# Altium project slave.PrjPcb
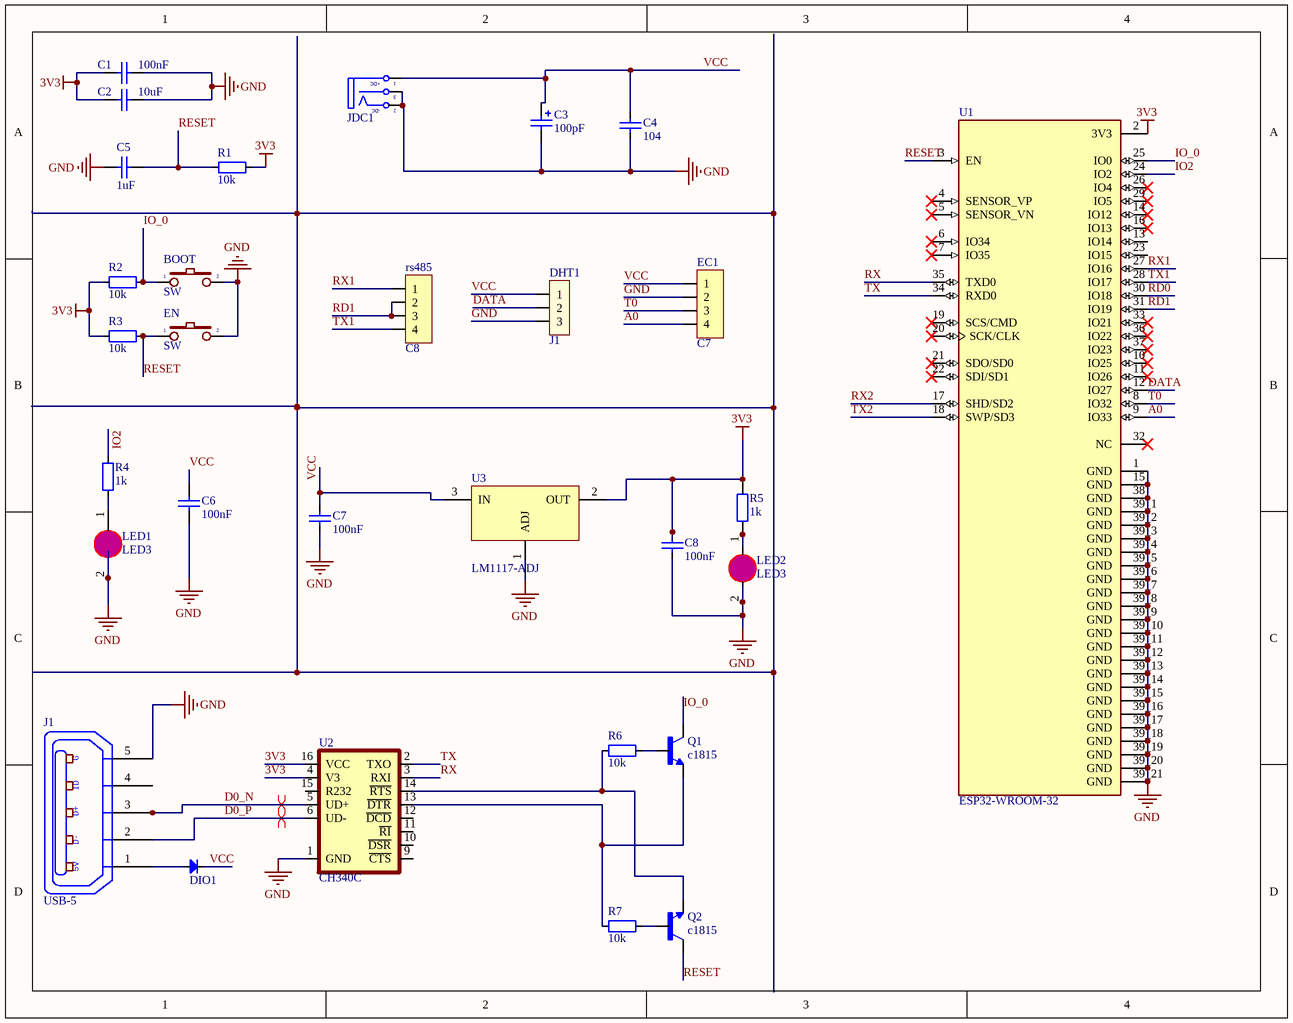
[diagram p0: mach slave.SchDoc]
1 sheet, 30 parts. Net scope: global (net labels, ports and power ports of the same name join across sheets).
Board file: slave.PcbDoc

## Sheet mach slave.SchDoc
size A

### Parts
BOOT  SW  [SW-SMD]
C1  100nF  [CAP_0805]
C2  10uF  [CAP_0805]
C3  value 100pF  [CAP-ALU-SMD-C]  (hidden comment: Cap Pol SMD)
C4  104  [CAP_0805]
C5  1uF  [CAP_0805]
C6  100nF  [CAP_0805]
C7  100nF  [CAP_0805]
C8  100nF  [CAP_0805]
DHT1  J1  [JP3]
DIO1  Diode SMD  [DIO-SMD-106]  (value not drawn)
EC1  C7  [JP4-C1T]
EN  SW  [SW-SMD]
J1  USB-5  [USB-M1]
JDC1  Jack DC  [DC-IN]  (value not drawn)
LED1  LED3  [LED0805]
LED2  LED3  [LED0805]
Q1  c1815  [SOT95P240X97-3N]
Q2  c1815  [SOT95P240X97-3N]
R1  10k  [RES-SMD-0805]
R2  10k  [RES-SMD-0805]
R3  10k  [RES-SMD-0805]
R4  1k  [RES-SMD-0805]
R5  1k  [RES-SMD-0805]
R6  10k  [RES-SMD-0603]
R7  10k  [RES-SMD-0603]
rs485  C8  [JP4-C1T]
U1  ESP32-WROOM-32  [MODULE_ESP32-WROOM-32]
U2  CH340C  [SOP-16]
U3  LM1117-ADJ  [LM1117-SOP]

### Nets
3V3: C1.1 C2.1 C8.2 R1.1 R2.2 R3.2 R5.1 U1.2(3V3) U2.4(V3) U2.16(VCC) U3.2(OUT)
GND: BOOT.2 C1.2 C2.2 C3.2 C4.1 C5.2 C6.1 C7.1 C8.1 DHT1.3 EC1.2 EN.2 J1.5(P5) JDC1.2(TN) JDC1.3(S) LED1.2(K) LED2.2(K) U1.1(GND) U1.15(GND) U1.38(GND) U1.39_1(GND) U1.39_2(GND) U1.39_3(GND) U1.39_4(GND) U1.39_5(GND) U1.39_6(GND) U1.39_7(GND) U1.39_8(GND) U1.39_9(GND) U1.39_10(GND) U1.39_11(GND) U1.39_12(GND) U1.39_13(GND) U1.39_14(GND) U1.39_15(GND) U1.39_16(GND) U1.39_17(GND) U1.39_18(GND) U1.39_19(GND) U1.39_20(GND) U1.39_21(GND) U2.1(GND) U3.1(ADJ)
A0: EC1.4 U1.9(IO33)
D0_N: J1.3(P3) U2.5(UD+)
D0_P: J1.2(P2) U2.6(UD-)
DATA: DHT1.2 U1.12(IO27)
IO2: R4.2 U1.24(IO2)
IO_0: BOOT.1 Q1.3(C) R2.1 U1.25(IO0)
RD0: U1.30(IO18)
RD1: rs485.2 rs485.3 U1.31(IO19)
RESET: C5.1 EN.1 Q2.3(C) R1.2 R3.1 U1.3(EN)
RX: U1.35(TXD0) U2.3(RXI)
RX1: rs485.1 U1.27(IO16)
RX2: U1.17(SHD/SD2)
T0: EC1.3 U1.8(IO32)
TX: U1.34(RXD0) U2.2(TXO)
TX1: rs485.4 U1.28(IO17)
TX2: U1.18(SWP/SD3)
VCC: C3.1 C4.2 C6.2 C7.2 DHT1.1 DIO1.2(K) EC1.1 JDC1.1(T) U3.3(IN)
NetDIO1_1: DIO1.1(A) J1.1(P1)
NetLED1_1: LED1.1(A) R4.1
NetLED2_1: LED2.1(A) R5.2
NetQ1_1: Q1.1(B) R6.1
NetQ1_2: Q1.2(E) R7.2 U2.13(~{DTR})
NetQ2_1: Q2.1(B) R7.1
NetQ2_2: Q2.2(E) R6.2 U2.14(~{RTS})

Not connected (* = marked no-connect by the designer): J1 4(P4); U1 4(SENSOR_VP)* 5(SENSOR_VN)* 6(IO34)* 7(IO35)* 10(IO25)* 11(IO26)* 13(IO14) 14(IO12)* 16(IO13)* 19(SCS/CMD)* 20(SCK/CLK)* 21(SDO/SD0)* 22(SDI/SD1)* 23(IO15) 26(IO4)* 29(IO5)* 32(NC)* 33(IO21)* 36(IO22)* 37(IO23)*; U2 9(~{CTS}) 10(~{DSR}) 11(~{RI}) 12(~{DCD}) 15(R232)

### Layout directives
differential pair: D0_N, D0_P

### Notes on the sheet
- (in symbol Jack DC) +DC; -DC
- (in symbol USB-5) G; ID; D+; D-; 5V

### Library data of the parts
BOOT EN = SW2: Switch button 2 pin; Value: SW chip 2 pin
C1 C2 C4-C8 = CapSMD: Capacitor; Value: 33p; Published: 8-Jun-2000; LatestRevisionDate: 17-Jul-2002; LatestRevisionNote: Re-released for DXP Platform.; PackageReference: RAD-0.3; Publisher: Altium Limited
C3 = Cap Pol SMD: Polarized Capacitor (Radial)
DHT1 = JP3: Jumper 3; Value: J3
DIO1 = Diode SMD: Default Diode; Code - JEDEC: DO-214-AB; Value: 1N5007; Published: 8-Jun-2000; Revision: July-2002: Re-released for DXP Platform.; Publisher: Altium Limited
EC1 rs485 = JP4: WR-PHD 2.54 mm Angled Socket Header; Manufacturer: W¨¹rth Elektronik eiSos GmbH; partNo: 613004143121; ComponentLink1 Description: Manufacturer; ComponentLink2 Description: Datasheet; NoPins: 04; Created Date: 29 March 2013; ComponentLink1URL: http://www.we-online.com; ComponentLink2URL: http://katalog.we-online.de/em/datasheet/6130xx143121.pdf; Created by: Karrer Zheng
J1 = USB-5: Manufacturer: FCI; Manufacturer Part Number: 10118193-0001LF; Connector Type: USB - micro B; Number of Contacts: 5; Gender: Receptacle; Specifications: USB 2.0; .Creator: MM; .Checked PCB: RF; Supplier 1: Digi-Key; RoHS: RoHS Compliant; Category: Connectors, Interconnects; Stock 1: 28642; Pricing 1: 1=0.46, 10=0.433, 25=0.3712, 50=0.3156, 100=0.3032, 250=0.27224, 500=0.25988 (USD); Packaging: Cut Tape (CT); Mounting Type: Surface Mount, Right Angle, Horizontal; Features: Shielded, Solder Retention; Ingress Protection: -; ComponentLink1URL: http://portal.fciconnect.com/Comergent//fci/drawing/10118193.pdf; ComponentLink1Description: http://portal.fciconnect.com/Comergent//fci/drawing/10118193.pdf; Supplier Part Number 1: 609-4616-1-ND; .Checked SCH: MM
JDC1 = Jack DC: Jack DC input; Value: Jac DC
LED1 LED2 = LED0805: LED SMD 0805
Q1 Q2 = BC817: Bipolar (BJT) Transistor NPN 45V 500mA 100MHz 250mW Surface Mount TO-236AB; MF: Rectron; MP: BC817; Value: *; SnapEDA_Link: https://www.snapeda.com/parts/BC817/Rectron/view-part/?ref=snap; Availability: In Stock; Purchase-URL: https://pricing.snapeda.com/search/part/BC817/?ref=eda; Package: SOT-23-3 Rectron; Price: None; Check_prices: https://www.snapeda.com/parts/BC817/Rectron/view-part/?ref=eda
R1-R4 R6 R7 = Resistor - SMD: Resistor; Manufacturer: Generic Components; Class: Passive; Published: 08/06/2000; Publisher: Altium Hobart Technology Centre
R5 = Resistor - SMD: 22; Manufacturer: Generic Components; Class: Passive; Published: 08/06/2000; Publisher: Altium Hobart Technology Centre
U1 = ESP32-WROOM-32: Bluetooth, WiFi 802.11b/g/n, Bluetooth v4.2 +EDR, Class 1, 2 and 3 Transceiver Module 2.4GHz ~ 2.5GHz Antenna Not Included, U.FL Surface Mount; MF: Espressif Systems; Price: None; Availability: In Stock; MP: ESP32-WROOM-32; Package: Module Espressif Systems; SnapEDA_Link: https://www.snapeda.com/parts/ESP32-WROOM-32/Espressif+Systems/view-part/?ref=snap; Check_prices: https://www.snapeda.com/parts/ESP32-WROOM-32/Espressif+Systems/view-part/?ref=eda; Value: *; Purchase-URL: https://pricing.snapeda.com/search/part/ESP32-WROOM-32/?ref=eda
U2 = CH340C: USB to serial chip CH340; MF: WCH; Package: Package; Check_prices: https://www.snapeda.com/parts/CH340C/WCH/view-part/5428851/?ref=eda; Value: *; Price: None; MP: CH340C; Availability: Unavailable; SnapEDA_Link: https://www.snapeda.com/parts/CH340C/WCH/view-part/5428851/?ref=snap
U3 = LM1117-ADJ: 800mA Low-Dropout Linear Regulator; Creator: Nguyen Ba Bien; Website: http://group3i.net